# EAGLE schematic QFN28 3mm v1.0 (EAGLE 7.2.0)
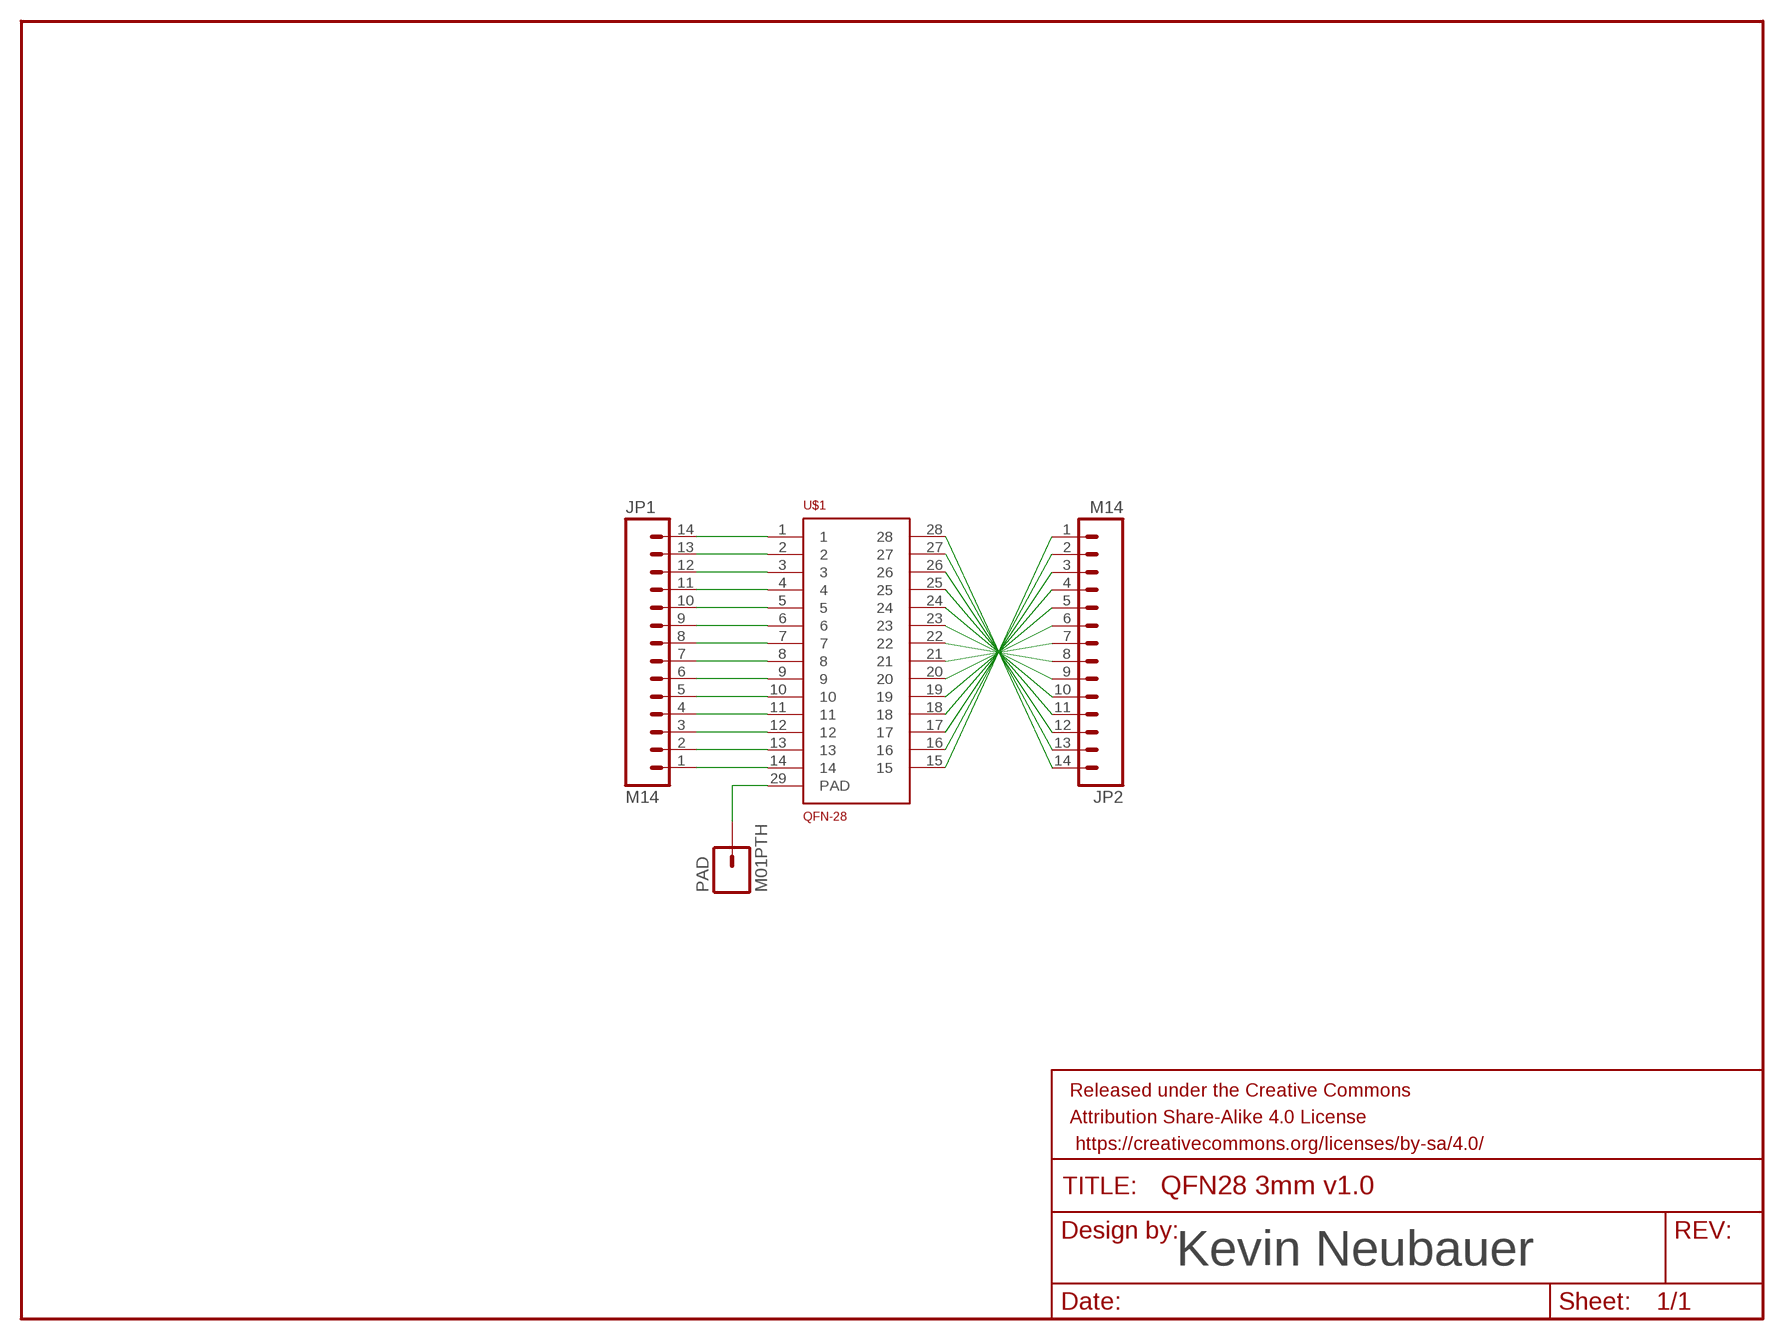
[diagram p0: schematic, sheet 1]

## Parts
FRAME1  FRAME-LETTER  [CREATIVE_COMMONS]
JP1  M14  [1X14]
JP2  M14  [1X14]
PAD  M01PTH  [1X01]
U$1  QFN-28  [QFN-28]

## Nets
GND: PAD.1 U$1.29(PAD)
N$1: JP1.14 U$1.1
N$2: JP1.13 U$1.2
N$3: JP1.12 U$1.3
N$4: JP1.11 U$1.4
N$5: JP1.10 U$1.5
N$6: JP1.9 U$1.6
N$7: JP1.8 U$1.7
N$8: JP1.7 U$1.8
N$9: JP1.6 U$1.9
N$10: JP1.5 U$1.10
N$11: JP1.4 U$1.11
N$12: JP1.3 U$1.12
N$13: JP1.2 U$1.13
N$14: JP1.1 U$1.14
N$15: JP2.1 U$1.15
N$16: JP2.2 U$1.16
N$17: JP2.3 U$1.17
N$18: JP2.4 U$1.18
N$19: JP2.5 U$1.19
N$20: JP2.6 U$1.20
N$21: JP2.7 U$1.21
N$22: JP2.8 U$1.22
N$23: JP2.9 U$1.23
N$24: JP2.10 U$1.24
N$25: JP2.11 U$1.25
N$26: JP2.12 U$1.26
N$27: JP2.13 U$1.27
N$28: JP2.14 U$1.28

## Notes on the sheet
- Kevin Neubauer

## Library data of the parts
FRAME1 = SparkFun-Aesthetics:FRAME-LETTER: Schematic Frame Standard 8.5x11 US Letter frame
JP1 JP2 = SparkFun-Connectors:M14: Header 14 Standard 14-pin 0.1" header. Use with straight break away headers (SKU : PRT-00116), right angle break away headers (PRT-00553), swiss pins (PRT-00743), machine pins (PRT-00117), and female headers (PRT-00115).
PAD = SparkFun-Connectors:M01: Header 1 Standard 1-pin 0.1" header. Use with straight break away headers (SKU : PRT-00116), right angle break away headers (PRT-00553), swiss pins (PRT-00743), machine pins (PRT-00117), and female headers (PRT-00115).
U$1 = Kevin-GenericICFootprints:QFN-28